# EAGLE board ACE2NOKB (EAGLE 9.4.2), part 1 of 2
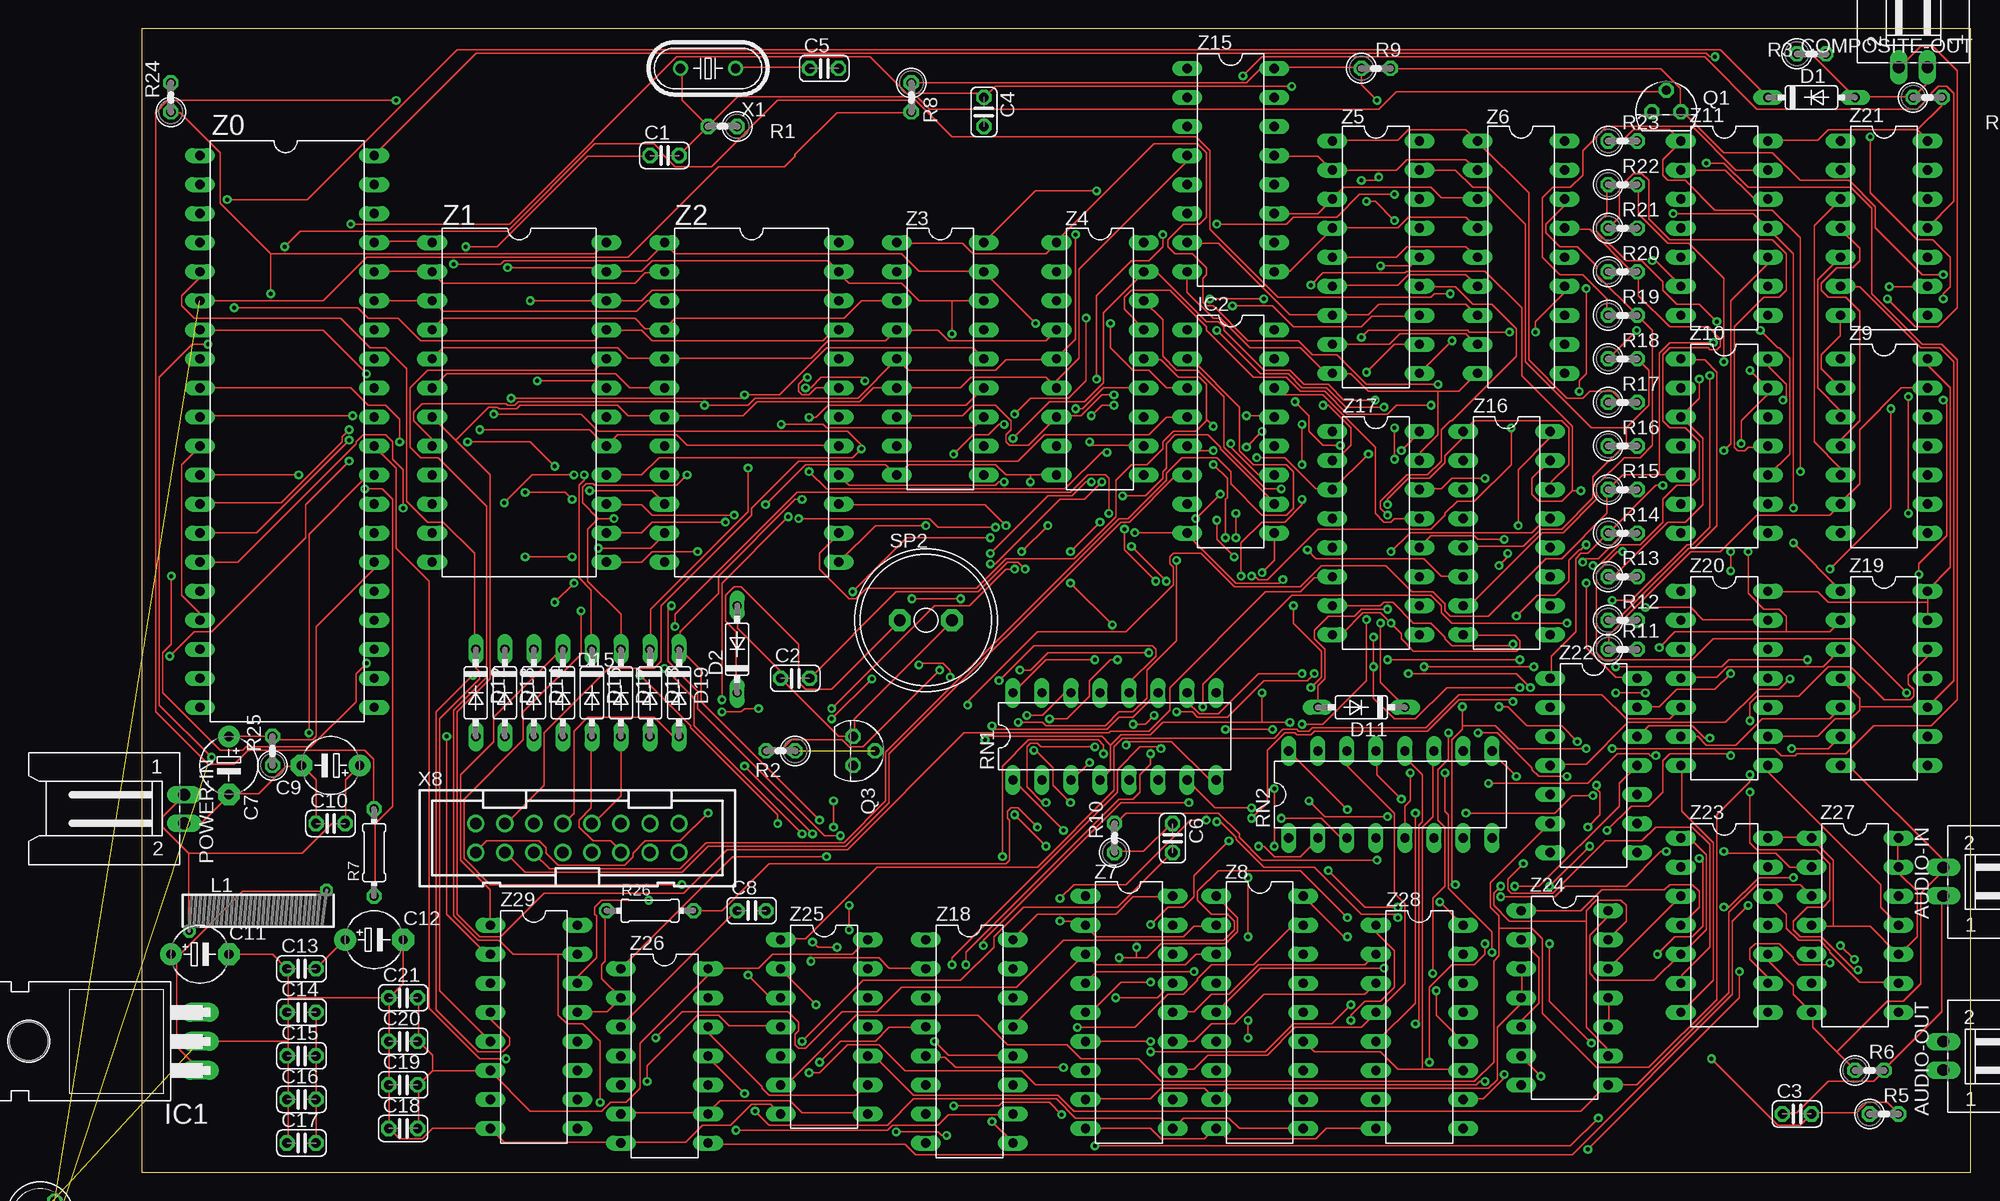
[diagram p2: board, top side]
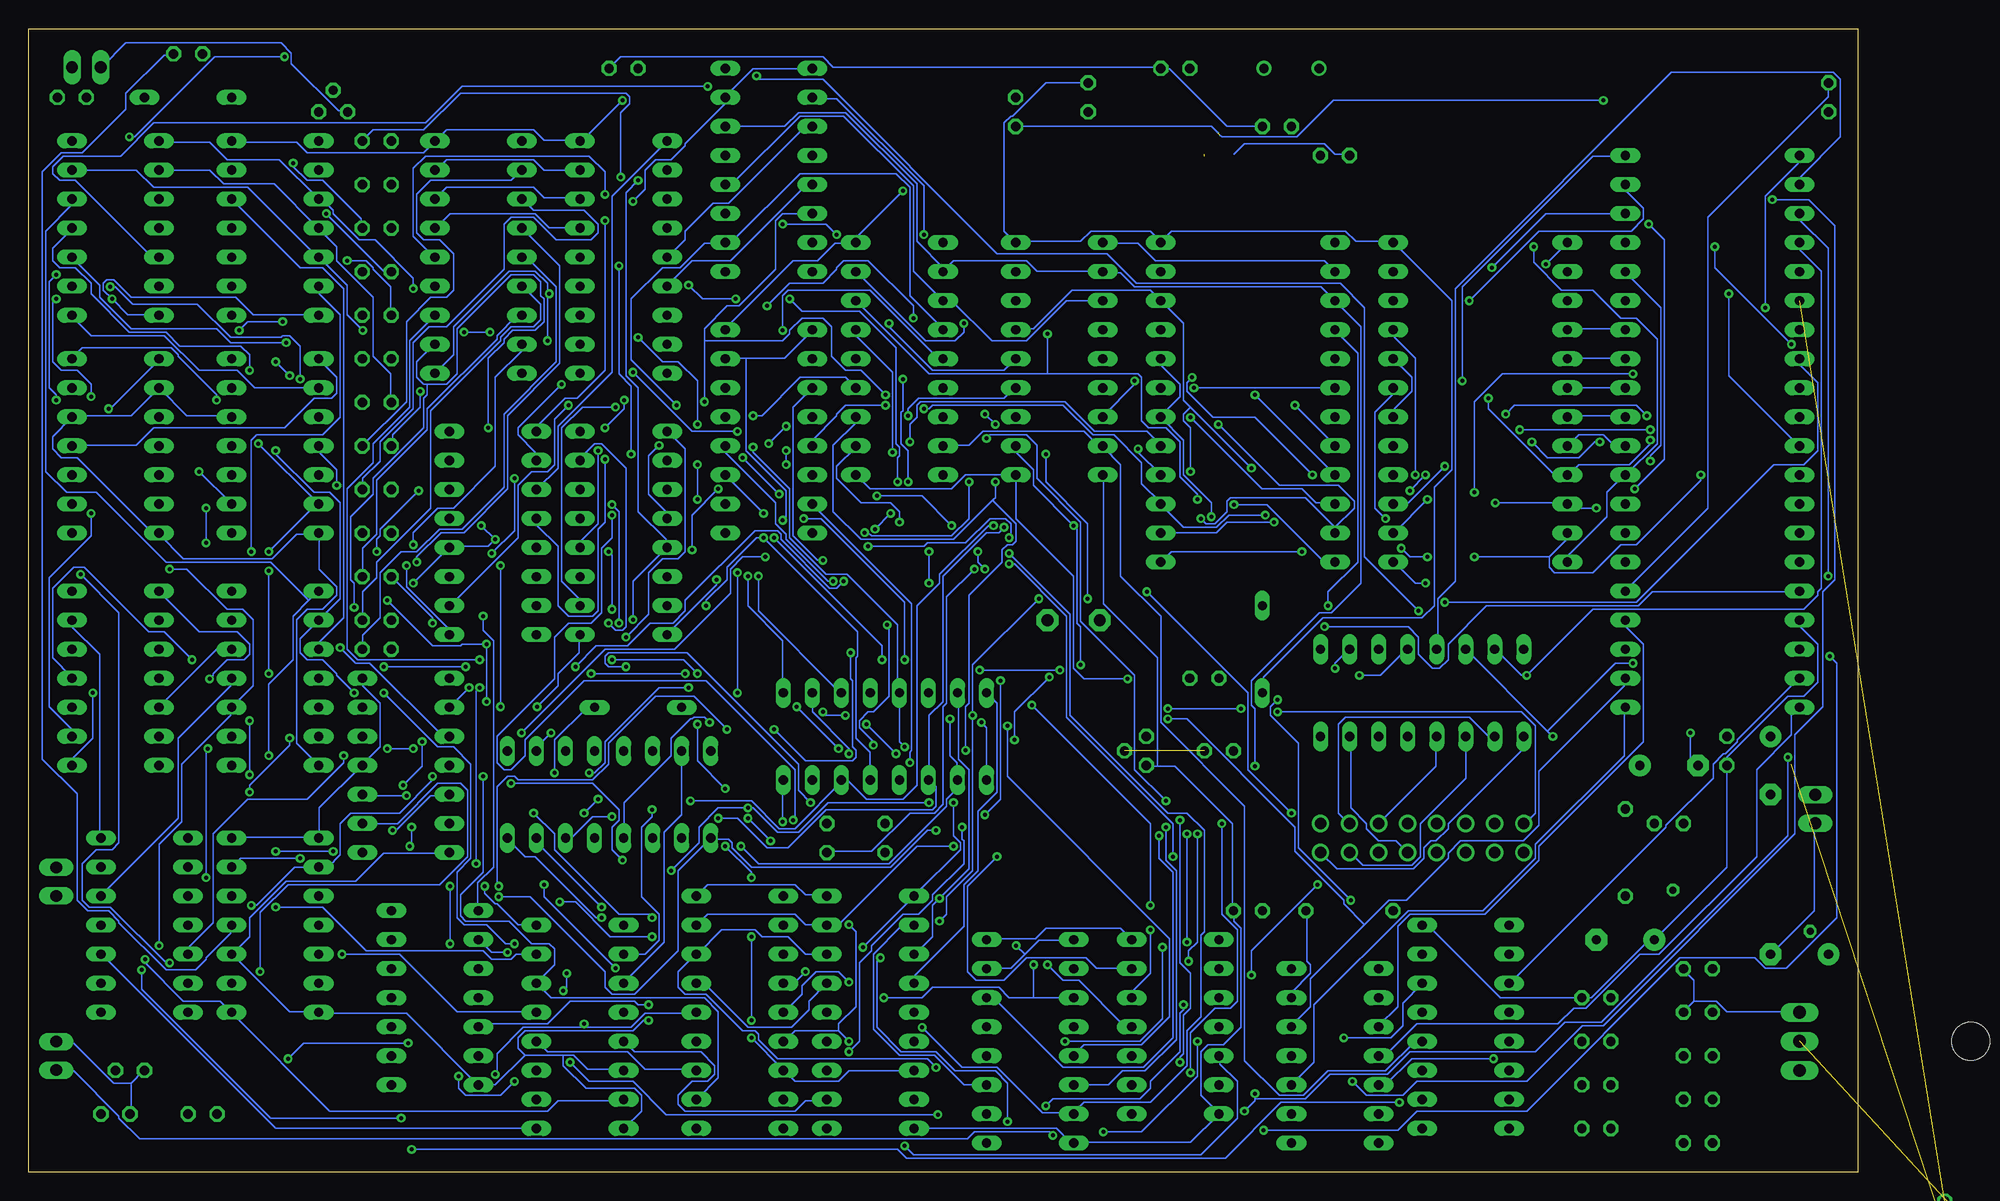
[diagram p3: board, bottom side, seen from below]

Size 160 x 100 mm. Coordinates in mm from the lower left corner, seen from the top.
Outline: 0,0 160,0 160,100 0,100 0,0
Copper layers (1*16): Top 0.035mm / dielectric 1.5mm / Bottom 0.035mm
Design rules "default": minimum track width 6mil, minimum drill 0.35mm, track to track 6mil, track to pad 6mil, pad to pad 6mil, via to via 6mil, smd to smd 6mil, copper to edge 40mil, drill to drill 6mil, minimum pad ring 10mil, minimum via ring 8mil, stop-mask expansion 4mil, vias tented up to drill 0mil, thermal gap 10mil

## Footprints (pad centres in the part's own frame; a part is rotated, then mirrored left to right if it is on the bottom)
L02P = drill 1.016 long: 1 1.25,-6.25; 2 -1.25,-6.25
C025-024X044 = drill 0.813 octagon: 1 -1.27,0; 2 1.27,0
E5-5 = drill 0.813 pad 1.905: + -2.54,0 | drill 0.813 pad 1.905 octagon: - 2.54,0
DO35-7 = drill 0.813 long: A 3.81,0; C -3.81,0
TO220H = drill 1.118 long: 1 -2.54,-10.16; 2 0,-10.16; 3 2.54,-10.16 | hole 3.302: 0,4.826
DIL16 = drill 0.813 long: 1 -8.89,-3.81; 2 -6.35,-3.81; 3 -3.81,-3.81; 4 -1.27,-3.81; 5 1.27,-3.81; 6 3.81,-3.81; 7 6.35,-3.81; 8 8.89,-3.81; 9 8.89,3.81; 10 6.35,3.81; 11 3.81,3.81; 12 1.27,3.81; 13 -1.27,3.81; 14 -3.81,3.81; 15 -6.35,3.81; 16 -8.89,3.81
Z15/4 = drill 0.6 octagon: 1 -6,-1.8; 2 6,1.8
TO92 = drill 0.813 octagon: 1 1.27,0; 2 0,1.905; 3 -1.27,0
TO18 = drill 0.813 octagon: 1 -1.27,-1.27; 2 1.27,-1.27; 3 1.27,1.27
0207/2V = drill 0.813 octagon: 1 -1.27,0; 2 1.27,0
0204/7 = drill 0.813 octagon: 1 -3.81,0; 2 3.81,0
AL11P = drill 1.016 pad 1.905 octagon: + 2.286,0; - -2.286,0
HC49U-V = drill 0.813: 1 -2.413,0; 2 2.413,0
PAK100/2500-16 = drill 1 pad 1.422: 1 -8.89,-1.27; 2 -8.89,1.27; 3 -6.35,-1.27; 4 -6.35,1.27; 5 -3.81,-1.27; 6 -3.81,1.27; 7 -1.27,-1.27; 8 -1.27,1.27; 9 1.27,-1.27; 10 1.27,1.27; 11 3.81,-1.27; 12 3.81,1.27; 13 6.35,-1.27; 14 6.35,1.27; 15 8.89,-1.27; 16 8.89,1.27
DIL40 = drill 0.813 long: 1 -24.13,-7.62; 2 -21.59,-7.62; 3 -19.05,-7.62; 4 -16.51,-7.62; 5 -13.97,-7.62; 6 -11.43,-7.62; 7 -8.89,-7.62; 8 -6.35,-7.62; 9 -3.81,-7.62; 10 -1.27,-7.62; 11 1.27,-7.62; 12 3.81,-7.62; 13 6.35,-7.62; 14 8.89,-7.62; 15 11.43,-7.62; 16 13.97,-7.62; 17 16.51,-7.62; 18 19.05,-7.62; 19 21.59,-7.62; 20 24.13,-7.62; 21 24.13,7.62; 22 21.59,7.62; 23 19.05,7.62; 24 16.51,7.62; 25 13.97,7.62; 26 11.43,7.62; 27 8.89,7.62; 28 6.35,7.62; 29 3.81,7.62; 30 1.27,7.62; 31 -1.27,7.62; 32 -3.81,7.62; 33 -6.35,7.62; 34 -8.89,7.62; 35 -11.43,7.62; 36 -13.97,7.62; 37 -16.51,7.62; 38 -19.05,7.62; 39 -21.59,7.62; 40 -24.13,7.62
DIL24 = drill 0.813 long: 1 -13.97,-7.62; 2 -11.43,-7.62; 3 -8.89,-7.62; 4 -6.35,-7.62; 5 -3.81,-7.62; 6 -1.27,-7.62; 7 1.27,-7.62; 8 3.81,-7.62; 9 6.35,-7.62; 10 8.89,-7.62; 11 11.43,-7.62; 12 13.97,-7.62; 13 13.97,7.62; 14 11.43,7.62; 15 8.89,7.62; 16 6.35,7.62; 17 3.81,7.62; 18 1.27,7.62; 19 -1.27,7.62; 20 -3.81,7.62; 21 -6.35,7.62; 22 -8.89,7.62; 23 -11.43,7.62; 24 -13.97,7.62
DIL18 = drill 0.813 long: 1 -10.16,-3.81; 2 -7.62,-3.81; 3 -5.08,-3.81; 4 -2.54,-3.81; 5 0,-3.81; 6 2.54,-3.81; 7 5.08,-3.81; 8 7.62,-3.81; 9 10.16,-3.81; 10 10.16,3.81; 11 7.62,3.81; 12 5.08,3.81; 13 2.54,3.81; 14 0,3.81; 15 -2.54,3.81; 16 -5.08,3.81; 17 -7.62,3.81; 18 -10.16,3.81
DIL14 = drill 0.813 long: 1 -7.62,-3.81; 2 -5.08,-3.81; 3 -2.54,-3.81; 4 0,-3.81; 5 2.54,-3.81; 6 5.08,-3.81; 7 7.62,-3.81; 8 7.62,3.81; 9 5.08,3.81; 10 2.54,3.81; 11 0,3.81; 12 -2.54,3.81; 13 -5.08,3.81; 14 -7.62,3.81

## Placement (x,y rotation side)
AUDIO-IN  [L02P]  163.83,25.4 270 top
AUDIO-OUT  [L02P]  163.83,10.16 270 top
C1  47N  [C025-024X044]  45.72,88.9 0 top
C2  47N  [C025-024X044]  57.15,43.18 0 top
C3  47N  [C025-024X044]  144.78,5.08 0 top
C4  42p  [C025-024X044]  73.66,92.71 270 top
C5  47N  [C025-024X044]  59.69,96.52 0 top
C6  47N  [C025-024X044]  90.17,29.21 270 top
C7  1U  [E5-5]  7.62,35.56 270 top
C8  2N2  [C025-024X044]  53.34,22.86 0 top
C9  100u  [E5-5]  16.51,35.56 180 top
C10  100N  [C025-024X044]  16.51,30.48 0 top
C11  100u  [E5-5]  5.08,19.05 0 top
C12  100u  [E5-5]  20.32,20.32 0 top
C13  100N  [C025-024X044]  13.97,17.78 0 top
C14  100N  [C025-024X044]  13.97,13.97 0 top
C15  100N  [C025-024X044]  13.97,10.16 0 top
C16  100N  [C025-024X044]  13.97,6.35 0 top
C17  100N  [C025-024X044]  13.97,2.54 0 top
C18  100N  [C025-024X044]  22.86,3.81 0 top
C19  100N  [C025-024X044]  22.86,7.62 0 top
C20  100N  [C025-024X044]  22.86,11.43 0 top
C21  100N  [C025-024X044]  22.86,15.24 0 top
COMPOSITE-OUT  [L02P]  154.94,102.87 0 top
D1  1N4148DO35-7  [DO35-7]  146.05,93.98 0 top
D2  1N4148DO35-7  [DO35-7]  52.07,45.72 90 top
D11  1N4148DO35-7  [DO35-7]  106.68,40.64 180 top
D12  1N4148DO35-7  [DO35-7]  29.21,41.91 270 top
D13  1N4148DO35-7  [DO35-7]  31.75,41.91 270 top
D14  1N4148DO35-7  [DO35-7]  34.29,41.91 270 top
D15  1N4148DO35-7  [DO35-7]  36.83,41.91 270 top
D16  1N4148DO35-7  [DO35-7]  39.37,41.91 270 top
D17  1N4148DO35-7  [DO35-7]  41.91,41.91 270 top
D18  1N4148DO35-7  [DO35-7]  44.45,41.91 270 top
D19  1N4148DO35-7  [DO35-7]  46.99,41.91 270 top
IC1  7805T  [TO220H]  -5.08,11.43 90 top
IC2  74367N  [DIL16]  95.25,64.77 270 top
L1  [Z15/4]  10.16,22.86 0 top
POWER-IN  [L02P]  -2.54,31.75 90 top
Q1  2N3904  [TO92]  133.35,92.71 0 top
Q2  2N2369  [TO18]  -8.89,-3.81 0 top  (outside the outline)
Q3  BC237  [TO92]  62.23,36.83 270 top
R1  47k  [0207/2V]  50.8,91.44 180 top
R2  12k  [0207/2V]  55.88,36.83 180 top
R3  1K5  [0207/2V]  146.05,97.79 0 top
R4  1K5  [0207/2V]  156.21,93.98 0 top
R5  12k  [0207/2V]  152.4,5.08 0 top
R6  1K  [0207/2V]  151.13,8.89 0 top
R7  1k0  [0204/7]  20.32,27.94 90 top
R8  270R  [0207/2V]  67.31,93.98 270 top
R9  47k  [0207/2V]  107.95,96.52 0 top
R10  10k  [0207/2V]  85.09,29.21 90 top
R11  1k  [0207/2V]  129.54,45.72 0 top
R12  1k  [0207/2V]  129.54,48.26 0 top
R13  1k  [0207/2V]  129.54,52.07 0 top
R14  1k  [0207/2V]  129.54,55.88 0 top
R15  1k  [0207/2V]  129.54,59.69 0 top
R16  1k  [0207/2V]  129.54,63.5 0 top
R17  1k  [0207/2V]  129.54,67.31 0 top
R18  1k  [0207/2V]  129.54,71.12 0 top
R19  1k  [0207/2V]  129.54,74.93 0 top
R20  1k  [0207/2V]  129.54,78.74 0 top
R21  1k  [0207/2V]  129.54,82.55 0 top
R22  1k  [0207/2V]  129.54,86.36 0 top
R23  1k  [0207/2V]  129.54,90.17 0 top
R24  10k  [0207/2V]  2.54,93.98 90 top
R25  220k  [0207/2V]  11.43,36.83 90 top
R26  330R  [0204/7]  44.45,22.86 0 top
RN1  1K0  [DIL16]  85.09,38.1 0 top
RN2  1K0  [DIL16]  109.22,33.02 0 top
SP2  AL11P  [AL11P]  68.58,48.26 0 top
X1  6.556MHz  [HC49U-V]  49.53,96.52 180 top
X8  2516-  [PAK100/2500-16]  38.1,29.21 0 top
Z0  [DIL40]  12.7,64.77 270 top
Z1  [DIL24]  33.02,67.31 270 top
Z2  [DIL24]  53.34,67.31 270 top
Z3  [DIL18]  69.85,71.12 270 top
Z4  [DIL18]  83.82,71.12 270 top
Z5  [DIL18]  107.95,80.01 270 top
Z6  [DIL18]  120.65,80.01 270 top
Z7  [DIL18]  86.36,13.97 270 top
Z8  [DIL18]  97.79,13.97 270 top
Z9  74LS393N  [DIL14]  152.4,63.5 270 top
Z10  74LS393N  [DIL14]  138.43,63.5 270 top
Z11  74LS393N  [DIL14]  138.43,82.55 270 top
Z15  74367N  [DIL16]  95.25,87.63 270 top
Z16  74367N  [DIL16]  119.38,55.88 270 top
Z17  74367N  [DIL16]  107.95,55.88 270 top
Z18  74367N  [DIL16]  72.39,11.43 270 top
Z19  74LS00N  [DIL14]  152.4,43.18 270 top
Z20  74LS08N  [DIL14]  138.43,43.18 270 top
Z21  74LS11N  [DIL14]  152.4,82.55 270 top
Z22  74LS11N  [DIL14]  127,35.56 270 top
Z23  74LS86N  [DIL14]  138.43,21.59 270 top
Z24  74LS02N  [DIL14]  124.46,15.24 270 top
Z25  74LS02N  [DIL14]  59.69,12.7 270 top
Z26  74LS32N  [DIL14]  45.72,10.16 270 top
Z27  74LS74N  [DIL14]  149.86,21.59 270 top
Z28  74LS166N  [DIL16]  111.76,12.7 270 top
Z29  74LS138N  [DIL16]  34.29,12.7 270 top

## Tracks (layer width: path | path; a pad name or v marks a point on that pad's centre or on a via)
+9VDC
  Top 0.152: 3.05,19.05 2.59,19.05 C11.+ 3.05,19.05 | 3.05,19.05 3.35,19.05 8.84,24.54 16.15,24.54 L1.2 | 3.05,19.05 3.05,10.97 5.03,8.99 IC1.1
/BUSRQ
  Bottom 0.152: R24.2 2.59,95.25 2.59,94.03 13.11,83.52 13.11,58.06 20.27,50.9 Z0.25
/CLK  (via drill 0.35)
  Top 0.152: v149.81,18.59 v148.59,19.81 | v153.01,66.75 153.01,58.06 v147.68,52.73
  Bottom 0.152: Z28.7 108.05,6.25 113.69,6.25 114.61,5.33 133.66,5.33 142.19,13.87 Z23.8 142.34,14.02 143.26,14.94 146.46,14.94 149.81,18.29 v149.81,18.59 | v148.59,19.81 148.59,28.65 146.61,30.63 146.61,35.66 142.34,39.93 142.34,40.54 Z20.10 142.19,40.69 140.36,42.52 140.36,48.31 141.28,49.23 142.65,49.23 146.15,52.73 v147.68,52.73 | v153.01,66.75 152.86,66.75 148.59,71.02 Z9.1
/INT  (via drill 0.35)
  Top 0.152: v46.63,47.7 46.63,48.77 57.3,59.44 81.23,59.44 82.75,60.96 84.28,60.96 84.58,60.66 v84.58,57.61 | v85.95,56.24 85.95,54.41 v88.7,51.66 | v121.77,44.2 v112.17,44.2 | v128.93,44.2 138.23,44.2 138.84,44.81 v145.69,44.81
  Bottom 0.152: v46.63,47.7 39.32,47.7 38.41,46.79 38.41,45.26 37.19,44.04 36.58,44.04 35.81,44.81 35.81,46.18 32.46,49.53 19.2,49.53 17.98,50.75 5.18,50.75 Z0.16 | v85.95,56.24 v84.58,57.61 | v88.7,51.66 89.31,51.05 89.92,51.05 94.18,55.32 94.18,55.78 94.49,56.08 96.47,56.08 102.56,49.99 102.56,49.07 103.63,48.01 105.61,48.01 107.59,46.02 110.34,46.02 v112.17,44.2 | v128.93,44.2 v121.77,44.2 | v145.69,44.81 148.13,47.24 149.5,47.24 155.14,52.88 156.06,52.88 157.89,51.05 157.89,44.96 156.21,43.28 Z19.11
/IOREQ
  Bottom 0.152: Z26.4 41.91,10.21 41.3,10.21 38.56,12.95 26.21,12.95 24.84,14.33 23.77,14.33 19.05,19.05 17.37,19.05 8.84,27.58 8.84,35.2 5.79,38.25 5.79,39.93 5.18,40.54 Z0.20
/MREQ
  Bottom 0.152: Z0.19 5.18,43.13 10.52,37.8 10.52,37.64 11.58,36.58 11.73,36.58 12.65,35.66 12.65,34.44 16.76,30.33 16.76,30.18 30.48,16.46 Z29.3
/RD
  Bottom 0.152: Z26.10 47.55,9.6 47.55,14.63 39.32,22.86 32.77,22.86 28.19,27.43 28.19,28.65 20.42,36.42 20.42,40.54 Z0.21
/RESET
  Top 0.152: C7.+ R25.2 11.73,37.8 14.94,37.8 15.24,38.1 15.24,47.7 20.27,52.73 20.27,53.34 Z0.26
/VHOLD  (via drill 0.35)
  Top 0.152: v59.89,27.58 51.66,27.58 41.91,17.83 Z26.1 | v74.22,53.19 74.68,53.19 80.31,58.83 82.45,58.83 v83.97,60.35 | v98.15,76.35 v93.42,76.35 | v102.26,77.57 103.33,78.64 110.49,78.64 110.64,78.79 117.5,78.79 120.7,75.59 120.7,69.65 125.12,65.23 125.12,59.59 | 125.12,59.59 124.21,58.67 122.22,58.67 121.61,59.28 121.61,60.66 123.14,62.18 Z16.15 | v154.38,41.91 149.66,46.63 137.47,46.63 135.64,44.81 127.86,44.81 127.25,45.41 127.25,52.43 129.08,54.25 v129.54,54.25 | 125.12,59.59 v125.88,59.59
  Bottom 0.152: v59.89,27.58 59.89,30.48 69.19,39.78 69.19,48.62 73.76,53.19 v74.22,53.19 | v83.97,60.35 83.97,62.48 83.82,62.64 83.82,63.4 84.12,63.7 84.12,72.08 87.33,75.29 92.35,75.29 v93.42,76.35 | v98.15,76.35 101.04,76.35 v102.26,77.57 | v154.38,41.91 154.38,37.95 156.21,36.12 156.21,35.66 Z19.8 | v129.54,54.25 129.54,55.32 129.24,55.63 129.24,56.24 v125.88,59.59
/WAIT
  Top 0.152: C8.1 51.97,22.86 41.91,12.8 Z26.3
  Bottom 0.152: Z0.24 20.27,48.16 20.27,47.7 18.75,46.18 18.75,37.64 27.89,28.5 27.89,27.28 32.61,22.55 39.17,22.55 40.23,21.49 40.23,14.48 41.91,12.8 Z26.3
/WR  (via drill 0.35)
  Top 0.152: Z26.12 49.53,12.65 49.53,12.19 54.25,7.47 54.25,7.32 54.86,6.71 62.48,6.71 63.4,7.62 Z25.9 | v60.35,39.62 v63.86,43.13
  Bottom 0.152: Z4.10 86.41,59.74 79.25,59.74 78.03,60.96 73.76,60.96 Z3.10 73.61,60.96 73.61,57.15 68.58,52.12 68.58,44.04 67.67,43.13 v63.86,43.13 | 43.13,21.64 47.85,16.92 47.85,14.48 49.53,12.8 Z26.12 | 43.13,21.64 41,23.77 39.47,23.77 35.81,27.43 35.81,27.89 34.75,28.96 29.26,28.96 27.89,30.33 27.89,35.05 20.42,42.52 20.42,43.13 Z0.22 | v60.35,39.62 58.67,39.62 49.23,30.18 49.23,28.04 44.96,23.77 44.96,23.47 43.13,21.64
ADDRESS0  (via drill 0.35)
  Top 0.152: v31.85,9.91 29.57,9.91 25.15,14.33 25.15,51.66 22.25,54.56 22.25,61.57 20.42,63.4 Z0.30 | v108.66,66.9 105.31,66.9 103.63,68.58 101.5,68.58 100.28,69.8 97.84,69.8 v94.03,73.61 | v81.69,81.99 81.69,72.85 80.01,71.17 Z4.5 80.01,71.02 75.59,71.02 74.68,70.1 67.06,70.1 66.14,71.02 Z3.5 65.99,71.02 62.64,67.67 53.65,67.67 53.03,67.06 v49.23,67.06 48.92,67.36 32.92,67.36 32.61,67.06 32,67.06 31.85,67.21 24.54,67.21 23.77,66.45 23.77,65.68 25.3,64.16 25.3,63.55 Z1.8
  Bottom 0.152: Z0.30 20.42,63.55 21.34,63.55 22.25,64.47 24.38,64.47 25.3,63.55 Z1.8 | Z26.5 41.3,7.62 39.01,9.91 v31.85,9.91 | v49.23,67.06 45.72,63.55 Z2.8 | v108.66,66.9 111.56,66.9 113.39,65.08 113.39,51.66 111.86,50.14 111.86,49.53 Z17.10 | v94.03,73.61 94.03,76.66 93.57,77.11 86.41,77.11 80.47,71.17 80.01,71.17 Z4.5 | v81.69,81.99 81.69,86.26 89.31,93.88 91.44,93.88 Z15.2
ADDRESS1
  Top 0.152: 79.7,68.89 Z4.6 79.7,68.89 | 79.7,68.89 79.1,69.49 72.54,69.49 71.63,68.58 66.14,68.58 Z3.6 65.99,68.58 64.01,68.58 62.79,67.36 53.8,67.36 52.58,66.14 45.72,66.14 | 79.7,68.89 81.99,71.17 81.99,78.94 91.44,88.39 91.44,88.85 Z15.4 | 27.43,64.01 25.45,65.99 Z1.7 | 27.43,64.01 30.48,60.96 30.48,43.13 27.58,40.23 27.58,22.55 29.57,20.57 31.39,20.57 35.2,24.38 47.4,24.38 51.21,28.19 61.72,28.19 71.93,38.41 84.58,38.41 84.73,38.56 88.09,38.56 89.92,40.39 89.92,42.37 98.3,50.75 101.35,50.75 102.56,51.97 104.09,51.97 Z17.6 | 45.72,66.14 42.52,66.14 41.6,67.06 33.07,67.06 32.77,66.75 31.24,66.75 31.09,66.9 30.33,66.9 27.43,64.01 | 45.72,66.14 Z2.7 45.72,66.14
  Bottom 0.152: Z0.31 20.42,66.14 25.3,66.14 Z1.7
ADDRESS2  (via drill 0.35)
  Top 0.152: Z2.6 42.67,68.58 41.45,69.8 26.67,69.8 25.45,68.58 Z1.6 | Z3.7 66.14,66.14 71.78,66.14 72.69,67.06 74.68,67.06 76.05,65.68 76.05,64.92 75.59,64.47 75.59,63.86 75.89,63.55 77.57,63.55 80.01,65.99 Z4.7 80.01,66.14 82.14,66.14 83.97,67.97 v85.04,67.97 | v104.85,63.55 103.33,63.55 102.11,64.77 102.11,66.14 v100.89,67.36 | v58.06,68.58 58.52,68.58 59.44,69.49 62.94,69.49 v63.25,69.19
  Bottom 0.152: Z0.32 20.42,68.58 25.3,68.58 Z1.6 | v104.85,63.55 105.77,62.64 105.77,59.28 104.24,57.76 104.24,57.15 Z17.4 | 100.89,72.69 100.89,73.76 98.91,75.74 97.84,75.74 94.64,78.94 94.64,83.21 94.03,83.82 Z15.6 | 100.89,72.69 v100.89,67.36 | v85.04,67.97 87.17,70.1 88.54,70.1 89.76,71.32 89.76,73.91 90.53,74.68 92.35,74.68 93.42,73.61 93.42,73.3 94.03,72.69 100.89,72.69 | v58.06,68.58 Z2.6 | v63.25,69.19 63.25,68.89 65.99,66.14 Z3.7
ADDRESS3  (via drill 0.35)
  Top 0.152: 45.72,71.17 42.52,71.17 41.6,72.08 26.36,72.08 25.45,71.17 Z1.5 | 45.72,71.17 Z2.5 45.72,71.17 | Z4.4 80.01,73.61 79.1,72.69 70.56,72.69 69.65,73.61 66.14,73.61 Z3.4 65.99,73.61 65.08,72.69 60.05,72.69 58.52,71.17 45.72,71.17 | v103.33,67.06 103.78,67.06 105.77,65.08 105.77,63.55 104.55,62.33 104.24,62.33 Z17.2
  Bottom 0.152: Z0.33 20.42,71.17 25.3,71.17 Z1.5 | Z4.4 80.01,73.76 82.91,76.66 82.91,86.11 84.12,87.33 92.51,87.33 98.45,81.38 99.06,81.38 Z15.10 99.06,81.23 100.89,81.23 103.02,79.1 104.55,79.1 107.29,76.35 107.29,71.02 v103.33,67.06
ADDRESS4  (via drill 0.35)
  Top 0.152: 45.72,73.76 44.04,73.76 43.13,74.68 26.36,74.68 25.45,73.76 Z1.4 | 45.72,73.76 Z2.4 45.72,73.76 | v61.11,29.41 59.74,29.41 48.62,40.54 48.62,42.06 46.02,44.65 46.02,49.23 v46.33,49.53 | 45.72,73.76 46.63,74.68 61.42,74.68 62.94,76.2 65.99,76.2 Z3.3
  Bottom 0.152: Z3.3 66.14,76.2 69.19,76.2 72.69,72.69 75.74,72.69 79.25,76.2 Z4.3 82.6,78.79 82.6,86.26 88.7,92.35 92.51,92.35 98.45,86.41 99.06,86.41 Z15.12 | Z0.34 20.42,73.76 25.3,73.76 Z1.4 | Z18.14 75.59,15.24 69.49,9.14 62.48,9.14 59.89,11.73 59.89,26.21 61.11,27.43 v61.11,29.41 | v46.33,49.53 46.33,50.75 43.74,53.34 43.74,71.63 45.72,73.61 Z2.4
ADDRESS5  (via drill 0.35)
  Top 0.152: Z0.35 20.42,76.2 25.3,76.2 Z1.3 25.45,76.2 26.36,75.29 43.28,75.29 44.2,76.2 Z2.3 | v69.34,11.43 70.56,10.21 76.2,10.21 Z18.12 | v60.81,19.66 59.13,19.66 v58.67,20.12 | v52.73,35.51 v58.67,29.57
  Bottom 0.152: 79.86,78.94 80.01,78.79 Z4.2 79.86,78.94 | 79.86,78.94 79.1,79.7 72.69,79.7 71.78,78.79 66.14,78.79 Z3.2 65.99,78.64 64.47,78.64 63.25,77.42 46.94,77.42 Z2.3 43.43,73.91 43.43,51.51 46.02,48.92 47.09,48.92 53.03,42.98 53.03,40.84 52.73,40.54 v52.73,35.51 | Z15.14 93.88,91.44 92.66,92.66 88.54,92.66 82.3,86.41 82.3,81.38 79.86,78.94 | v69.34,11.43 62.79,11.43 60.81,13.41 v60.81,19.66 | v58.67,29.57 v58.67,20.12
ADDRESS6  (via drill 0.35)
  Top 0.152: Z3.1 66.14,81.23 71.78,81.23 72.69,80.31 79.1,80.31 80.01,81.23 Z4.1 80.01,81.38 88.54,89.92 92.35,89.92 93.12,89.15 93.12,83.52 92.51,82.91 91.14,82.91 89.76,81.53 89.76,80.92 90.37,80.31 91.9,80.31 93.12,79.1 93.12,78.49 92.81,78.18 92.81,76.05 93.12,75.74 93.73,75.74 96.77,72.69 101.19,72.69 102.41,71.48 104.55,71.48 107.14,68.89 v113.39,68.89 | Z0.36 20.42,78.79 25.3,78.79 Z1.2 25.45,78.64 26.36,77.72 43.13,77.72 44.04,78.64 45.72,78.64 Z2.2 | v51.97,3.66 65.23,3.66 65.68,4.12 69.65,4.12 70.56,5.03 76.2,5.03 Z18.10 | v2.44,45.11 4.57,47.24 6.1,47.24 14.33,55.47 14.33,58.37 v18.14,62.18
  Bottom 0.152: v113.39,68.89 117.2,65.08 117.2,64.47 115.67,62.94 115.67,62.33 Z16.2 | v51.97,3.66 40.23,3.66 38.56,5.33 28.96,5.33 15.54,18.75 8.99,18.75 8.08,17.83 6.25,17.83 1.83,22.25 1.83,44.5 v2.44,45.11 | v18.14,62.18 18.14,62.64 17.22,63.55 17.22,75.59 20.27,78.64 Z0.36 | Z3.1 65.99,81.23 62.94,81.23 61.42,79.7 46.63,79.7 45.72,78.79 Z2.2
ADDRESS7  (via drill 0.35)
  Top 0.152: Z0.37 20.42,81.38 25.3,81.38 Z1.1 | 45.72,81.23 46.63,80.31 66.45,80.31 67.97,78.79 73.61,78.79 Z3.17 73.76,78.64 v78.18,74.22 | 45.72,81.23 Z2.1 45.72,81.23 | v27.28,79.4 31.39,79.4 31.7,79.7 44.2,79.7 45.72,81.23 | v60.5,32.46 v60.5,30.18 | v76.2,64.16 79.4,67.36 82.45,67.36 84.12,69.04 84.12,75.13 87.63,78.64 | 87.63,78.64 Z4.17 87.63,78.64 | v109.58,65.08 v109.58,62.33 | v107.9,67.51 105.16,67.51 103.78,68.89 101.65,68.89 100.43,70.1 98.15,70.1 94.64,73.61 94.64,73.91 94.18,74.37 93.12,74.37 88.85,78.64 87.63,78.64
  Bottom 0.152: v27.28,79.4 25.45,81.23 Z1.1 | Z18.6 65.53,7.62 64.31,8.84 62.33,8.84 59.59,11.58 59.59,26.36 60.5,27.28 v60.5,30.18 | v60.5,32.46 63.25,35.2 63.25,43.43 67.97,48.16 67.97,56.84 71.78,60.66 71.78,63.55 72.69,64.47 75.89,64.47 v76.2,64.16 | v109.58,62.33 109.58,56.84 110.19,56.24 110.19,49.07 110.64,48.62 112.78,48.62 113.69,49.53 113.69,54.71 115.52,56.54 115.52,57.15 Z16.4 | v109.58,65.08 107.9,66.75 v107.9,67.51 | v78.18,74.22 78.18,73.46 78.94,72.69 81.53,72.69 87.63,78.79 Z4.17
ADDRESS8  (via drill 0.35)
  Top 0.152: 70.87,76.2 67.97,76.2 66.45,77.72 61.87,77.72 60.96,78.64 Z2.23 60.96,78.79 60.05,79.7 44.65,79.7 43.74,78.79 40.69,78.79 Z1.23 40.54,78.79 40.23,79.1 v32,79.1 | 70.87,76.2 73.61,76.2 Z3.16 | 47.09,45.72 47.09,47.24 50.44,50.6 50.44,52.12 57.15,58.83 v57.76,58.83 | 47.09,45.72 D19.C 47.09,45.72 | v59.28,9.6 61.11,11.43 64.16,11.43 65.38,12.65 68.58,12.65 Z18.4 | v59.28,30.79 48.92,41.15 48.92,43.89 47.09,45.72 | v101.96,54.41 102.72,53.65 112.17,53.65 113.69,52.12 115.52,52.12 Z16.6 | v99.67,59.74 98.3,59.74 94.64,63.4 94.64,67.82 92.35,70.1 90.53,70.1 89.31,71.32 89.31,74.52 Z4.16 | v70.87,73.3 70.87,76.2
  Bottom 0.152: v32,79.1 27.28,83.82 20.42,83.82 Z0.38 | v57.76,58.83 57.76,59.28 59.28,60.81 59.28,63.86 60.5,65.08 62.03,65.08 62.64,65.68 62.64,69.49 62.94,69.8 70.87,69.8 | 70.87,69.8 81.23,69.8 Z4.16 | v59.28,9.6 59.28,10.06 58.98,10.36 58.98,13.72 58.37,14.33 58.37,17.37 59.28,18.29 v59.28,30.79 | v101.96,54.41 101.96,57.45 v99.67,59.74 | 70.87,69.8 v70.87,73.3
ADDRESS9  (via drill 0.35)
  Top 0.152: v112.78,67.06 109.73,67.06 108.97,66.29 105.46,66.29 103.48,68.28 101.35,68.28 100.13,69.49 97.23,69.49 93.12,73.61 93.12,73.91 89.92,77.11 86.56,77.11 85.95,76.5 85.95,75.44 87.63,73.76 Z4.15 | v53.03,61.57 53.03,57.76 44.5,49.23 44.5,45.72 D18.C | v58.52,18.44 58.83,18.75 64.47,18.75 65.38,17.83 68.58,17.83 Z18.2 | v57.76,29.57 48.31,39.01 48.31,41.45 v45.72,44.04 | Z2.22 60.05,77.11 44.65,77.11 43.74,76.2 40.69,76.2 Z1.22 40.54,76.2 v33.98,76.2 | v84.43,62.94 83.97,62.94 80.77,59.74 59.89,59.74 v58.37,61.27
  Bottom 0.152: v112.78,67.06 114,65.84 114,61.87 114.61,61.27 115.98,61.27 117.2,60.05 117.2,55.47 123.14,49.53 Z16.10 | 58.37,66.9 58.98,67.51 58.98,74.22 Z2.22 61.87,77.11 68.73,77.11 72.08,73.76 73.61,73.76 Z3.15 | 58.37,66.9 v53.03,61.57 | v58.52,18.44 58.52,19.36 57.76,20.12 v57.76,29.57 | v45.72,44.04 45.72,44.5 44.5,45.72 D18.C | v33.98,76.2 27.89,82.3 19.81,82.3 18.75,83.36 18.75,84.28 20.27,85.8 20.27,86.26 Z0.39 | v84.43,62.94 84.43,69.95 87.63,73.15 87.63,73.61 Z4.15 | v58.37,61.27 58.37,65.08 58.98,65.68 58.98,66.29 58.37,66.9
ADDRESS10  (via drill 0.35)
  Top 0.152: 39.93,57.15 v41.3,57.15 | 39.93,57.15 39.01,56.24 39.01,51.66 41.91,48.77 D17.C | v34.59,69.19 39.93,69.19 40.54,68.58 Z1.19 | Z2.19 58.98,68.58 58.37,67.97 57.76,67.97 57.45,68.28 57.45,68.89 58.06,69.49 v58.22,69.49 | v47.7,60.96 46.79,60.05 39.62,60.05 39.47,60.2 38.86,60.2 38.56,59.89 38.56,58.52 39.93,57.15 | v154.53,67.82 v154.53,57.61 | v157.58,76.35 157.58,76.81 158.19,77.42 158.19,80.01 156.67,81.53 155.3,81.53 151.18,85.65 v151.18,90.53 | v137.62,97.54 137.16,97.54 136.85,97.84 29.26,97.84 20.42,89 Z0.40
  Bottom 0.152: v41.3,57.15 42.22,58.06 42.22,66.45 40.69,67.97 40.69,68.58 Z1.19 | v34.59,69.19 34.59,77.42 23.16,88.85 20.42,88.85 Z0.40 | v58.22,69.49 58.67,69.04 58.67,68.28 56.39,65.99 52.73,65.99 v47.7,60.96 | Z19.9 156.21,38.71 158.19,40.69 158.19,51.97 154.53,55.63 v154.53,57.61 | v154.53,67.82 154.53,68.89 155.75,70.1 157.12,70.1 157.89,70.87 157.89,76.05 v157.58,76.35 | v151.18,90.53 150.72,90.53 143.71,97.54 v137.62,97.54
ADDRESS11  (via drill 0.35)
  Top 0.152: Z2.21 60.96,73.61 60.5,73.61 59.59,72.69 44.65,72.69 43.74,73.61 40.69,73.61 Z1.21 40.54,73.61 39.62,72.69 24.38,72.69 22.4,74.68 19.81,74.68 18.9,75.59 v8.08,75.59 | v122.38,8.38 120.7,10.06 Z24.6 | v117.5,7.92 117.04,7.92 116.74,7.62 78.18,7.62 76.96,8.84 66.75,8.84 64.47,11.12 61.72,11.12 59.28,8.69 v58.37,8.69 | v55.63,30.48 55.63,31.24 48.01,38.86 48.01,39.01 v43.59,43.43 | v38.71,60.96 38.71,60.5 38.25,60.05 38.25,51.97 39.32,50.9 39.32,45.72 D16.C
  Bottom 0.152: v8.08,75.59 8.08,85.34 5.18,88.24 5.18,88.85 Z0.1 | v122.38,8.38 122.38,7.32 121.77,6.71 118.72,6.71 v117.5,7.92 | v58.37,8.69 58.37,12.19 56.24,14.33 54.86,14.33 54.25,14.94 54.25,21.18 55.63,22.55 v55.63,30.48 | v43.59,43.43 41.76,43.43 39.47,45.72 D16.C | v38.71,60.96 38.71,71.17 40.54,73 40.54,73.61 Z1.21
ADDRESS12
  Top 0.152: Z29.1 30.48,21.64 30.48,24.69 27.89,27.28 27.89,34.75 30.79,37.64 30.79,39.78 36.73,45.72 D15.C
  Bottom 0.152: Z0.2 5.03,86.41 5.03,87.02 1.52,90.53 1.52,95.56 2.13,96.16 16.31,96.16 35.2,77.27 35.2,51.66 36.73,50.14 36.73,45.72 D15.C
ADDRESS13  (via drill 0.35)
  Top 0.152: Z29.2 30.18,19.05 26.67,22.55 v26.67,38.1 | v2.59,52.12 2.59,46.18 1.83,45.41 1.83,41.91 6.86,36.88 8.84,36.88 9.14,37.19 14.78,37.19 18.75,41.15 18.75,43.59 v19.66,44.5
  Bottom 0.152: D14.C 27.13,38.56 | 27.13,38.56 v26.67,38.1 | v2.59,52.12 2.59,80.77 5.03,83.21 5.03,83.82 Z0.3 | v19.66,44.5 21.18,44.5 27.13,38.56
ADDRESS14  (via drill 0.35)
  Top 0.152: v28.96,43.43 25.76,40.23 25.76,14.17 29.41,10.52 31.55,10.52 32.16,11.12 32.16,11.73 30.48,13.41 30.48,13.87 Z29.4
  Bottom 0.152: D13.C 31.7,45.72 29.41,43.43 v28.96,43.43 23.16,49.23 4.72,49.23 3.5,50.44 3.5,50.75 3.2,51.05 3.2,78.79 5.03,80.62 5.03,81.23 Z0.4
ADDRESS15
  Top 0.152: Z29.5 26.06,15.85 26.06,39.62 29.57,43.13 29.57,43.74 29.26,44.04 29.26,45.72 D12.C 29.11,45.72 29.11,54.1 26.36,56.84 24.99,56.84 23.16,58.67 23.16,70.26 21.34,72.08 19.96,72.08 17.37,74.68 4.57,74.68 3.5,75.74 3.5,76.66 5.03,78.18 5.03,78.64 Z0.5
CNT0  (via drill 0.35)
  Top 0.152: Z21.5 146.61,78.03 146.61,68.58 148.59,66.6 148.59,66.14 Z9.3 | v19.51,59.74 21.03,59.74 21.95,58.83 21.95,32 20.42,30.48 20.42,24.23 R7.1 | v18.29,82.91 32.16,82.91 46.79,97.54 63.7,97.54 66.9,94.34 73.3,94.34 73.61,94.03 C4.1 73.76,94.03 74.68,94.94 v100.58,94.94
  Bottom 0.152: v19.51,59.74 16.92,62.33 16.92,81.53 v18.29,82.91 | Z21.5 149.2,80.01 155.91,86.72 157.28,86.72 157.89,87.33 157.89,87.94 156.97,88.85 151.94,88.85 149.05,91.75 125.27,91.75 122.07,94.94 v100.58,94.94
CNT1
  Top 0.152: Z9.4 148.59,63.55 148.59,64.01 150.27,65.68 150.27,75.29 149.05,76.5 147.52,76.5 146.91,77.11 146.91,77.72 148.28,79.1 149.66,79.1 150.27,79.7 150.27,80.77 148.59,82.45 Z21.4
CNT2
  Top 0.152: Z9.5 148.59,61.57 146.3,63.86 146.3,82.75 148.59,85.04 Z21.3
CNT3
  Top 0.152: R11.1 128.32,45.72 128.32,46.94 129.84,48.46 129.84,48.62 135.48,54.25 138.07,54.25 141.28,57.45 147.68,57.45 148.59,58.37 Z9.6 148.59,58.52 150.27,60.2 150.27,64.92 153.92,68.58 Z9.13
CNT4
  Top 0.152: R12.1 128.32,48.31 129.08,48.31 135.33,54.56 135.79,54.56 137.77,56.54 137.77,69.95 136.7,71.02 134.72,71.02 Z10.1
  Bottom 0.152: Z9.11 156.21,63.55 150.57,63.55 149.05,65.08 137.62,65.08 135.03,67.67 133.5,67.67 133.04,68.12 133.04,69.49 134.57,71.02 Z10.1
CNT5  (via drill 0.35)
  Top 0.152: v70.87,18.14 70.87,18.75 85.34,33.22 85.34,35.2 87.33,37.19 89,37.19 v89.15,37.03 | v92.81,40.69 92.81,42.67 100.58,50.44 112.78,50.44 113.69,49.53 113.69,48.92 114.61,48.01 v124.66,48.01 | R13.1 128.32,52.12 128.78,52.12 133.5,56.84 135.03,56.84 136.55,58.37 136.55,64.16 134.72,65.99 Z10.3 134.72,66.14 136.25,67.67 v136.25,69.34 | v152.86,77.42 156.21,77.42 Z21.9
  Bottom 0.152: v70.87,18.14 69.49,16.76 68.12,16.76 64.16,12.8 63.55,12.8 Z25.11 | v92.81,40.69 v89.15,37.03 | v124.66,48.01 124.66,48.46 128.17,51.97 R13.1 | v152.86,77.42 152.4,77.42 150.88,75.89 145.24,75.89 142.34,73 137.92,73 137.77,73.15 137.16,73.15 136.25,72.24 v136.25,69.34
CNT6  (via drill 0.35)
  Top 0.152: Z22.1 123.29,43.28 123.29,45.11 125.42,47.24 125.42,53.65 125.88,54.1 126.49,54.1 128.17,55.78 R14.1 128.32,55.93 132.44,60.05 v133.04,60.05
  Bottom 0.152: v133.04,60.05 133.04,61.42 134.57,62.94 134.57,63.4 Z10.4
CNT7  (via drill 0.35)
  Top 0.152: v61.87,23.32 v61.87,21.18 | v72.24,40.84 72.24,41.15 78.33,47.24 86.11,47.24 90.22,51.36 90.22,52.88 89.92,53.19 89.92,53.8 90.22,54.1 92.66,54.1 95.56,51.21 101.35,51.21 103.17,53.03 108.81,53.03 111.1,50.75 112.93,50.75 114,49.68 114,49.07 114.45,48.62 117.81,48.62 122.83,53.65 124.21,53.65 128.17,57.61 128.17,59.59 R15.1 128.32,59.74 129.54,60.96 132.74,60.96 | 132.74,60.96 134.57,60.96 Z10.5 | v137.47,72.54 133.66,72.54 132.74,71.63 132.74,60.96
  Bottom 0.152: v61.87,21.18 61.87,17.37 63.4,15.85 63.4,15.24 Z25.12 | v61.87,23.32 61.87,30.48 v72.24,40.84 | Z21.10 153.77,77.57 153.77,76.5 151.03,73.76 143.56,73.76 142.34,72.54 v137.47,72.54
CNT8  (via drill 0.35)
  Top 0.152: v138.99,43.59 137.62,42.22 134.26,42.22 132.74,40.69 130.91,40.69 Z22.13 | v138.99,54.25 v138.99,52.58 | 142.19,68.58 142.19,67.97 139.9,65.68 v139.9,63.7 | 142.19,68.58 Z10.13 142.19,68.58 | v53.03,17.22 55.02,15.24 55.78,15.24 Z25.3 | v47.24,25.15 30.48,25.15 28.19,27.43 28.19,32.61 33.38,37.8 33.38,40.23 38.41,45.26 v38.41,49.07 | v96.32,95.86 97.99,97.54 136.7,97.54 141.28,92.96 155.3,92.96 156.51,94.18 156.51,94.34 157.12,94.94 157.89,94.94 158.5,94.34 158.5,84.89 156.21,82.6 Z21.11 | v140.66,70.1 142.19,68.58
  Bottom 0.152: v138.99,52.58 v138.99,43.59 | 134.72,58.52 v138.99,54.25 | 134.72,58.52 Z10.6 134.72,58.52 | 134.72,58.52 v139.9,63.7 | v53.03,17.22 53.03,19.36 v47.24,25.15 | v38.41,49.07 43.13,53.8 43.13,75.59 45.26,77.72 63.09,77.72 65.68,80.31 75.29,80.31 90.53,95.56 96.01,95.56 v96.32,95.86 | v140.66,70.1 140.66,71.48 141.43,72.24 146.76,72.24 147.98,73.46 151.18,73.46 154.53,76.81 154.53,77.72 155.91,79.1 157.28,79.1 157.89,79.7 157.89,80.77 156.21,82.45 Z21.11
CNT9
  Top 0.152: Z10.11 142.19,63.4 140.51,63.4 140.21,63.09 139.6,63.09 139.29,63.4 139.29,73.91 141.88,76.5 143.26,76.5 143.87,77.11 143.87,80.31 142.65,81.53 133.66,81.53 131.83,83.36 131.83,86.72 131.22,87.33 130.45,87.33 129.24,86.11 129.24,83.52 128.32,82.6 R21.1
CNT10  (via drill 0.35)
  Top 0.152: v137.77,74.37 136.25,75.89 134.26,75.89 133.04,77.11 133.04,77.88 131.22,79.7 129.84,79.7 127.25,82.3 127.25,82.91 128.17,83.82 128.17,86.26 R22.1 | v141.58,73.61 143.1,72.08 143.26,72.08 144.17,71.17 144.17,62.79 142.34,60.96 Z10.10
  Bottom 0.152: v137.77,74.37 140.82,74.37 v141.58,73.61
CNT11  (via drill 0.35)
  Top 0.152: R23.1 128.32,90.22 129.54,90.22 130.45,91.14 133.66,91.14 134.57,90.22 Z11.1 134.57,90.07 133.04,88.54 133.04,87.17 133.5,86.72 135.03,86.72 137.62,84.12 142.65,84.12 145.09,81.69 v145.09,61.27
  Bottom 0.152: v145.09,61.27 142.34,58.52 Z10.9
CNT12  (via drill 0.35)
  Top 0.152: v125.73,68.28 125.73,69.19 126.34,69.8 v126.34,77.27
  Bottom 0.152: v125.73,68.28 125.73,66.9 128.17,64.47 128.17,63.55 R16.1 | v126.34,77.27 126.34,78.18 129.69,81.53 131.06,81.53 133.35,83.82 133.35,84.12 134.26,85.04 134.57,85.04 Z11.3 134.72,85.19 138.07,88.54 142.65,88.54 144.17,90.07 148.59,90.07 Z21.1
CNT13
  Bottom 0.152: R17.1 128.32,67.36 128.32,69.8 129.84,71.32 129.84,76.5 133.04,79.7 133.04,80.92 134.57,82.45 Z11.4 134.72,82.6 138.53,86.41 142.95,86.41 144.17,87.63 Z21.2
CNT14  (via drill 0.35)
  Top 0.152: v130.76,73.61 128.32,71.17 R18.1
  Bottom 0.152: v130.76,73.61 132.13,74.98 132.13,77.57 134.57,80.01 Z11.5 134.72,80.01 140.82,86.11 149.05,86.11 150.57,87.63 Z21.13
CNT15  (via drill 0.35)
  Top 0.152: v132.13,79.7 132.44,79.7 134.57,77.57 Z11.6 | Z11.13 142.19,87.63 139.45,87.63 135.64,91.44 128.17,91.44 126.03,89.31 126.03,87.17 124.97,86.11 123.44,86.11 122.53,85.19 122.53,80.01 124.05,78.49 126.03,78.49 128.17,76.35 128.17,74.98 R19.1 | v132.74,45.87 134.11,47.24 143.87,47.24 | 143.87,47.24 147.68,47.24 148.59,48.16 Z19.2 | v140.51,54.25 140.51,50.6 141.88,49.23 143.26,49.23 143.87,48.62 143.87,47.24
  Bottom 0.152: v132.13,79.7 130.45,79.7 129.84,79.1 129.84,78.94 128.32,77.42 128.32,74.98 R19.1 | v132.74,45.87 131.37,44.5 130.15,44.5 123.75,38.1 123.29,38.1 Z22.3 | v140.51,54.25 140.51,64.01 140.06,64.47 134.26,64.47 132.74,65.99 132.74,74.98 134.57,76.81 134.57,77.42 Z11.6
CNT16  (via drill 0.35)
  Top 0.152: v133.96,83.82 140.97,83.82 142.19,82.6 Z11.11 142.34,82.45 144.47,80.31 v144.47,58.06 | v144.17,43.13 143.26,42.22 141.43,42.22 138.53,39.32 130,39.32 126.34,35.66 123.29,35.66 Z22.4 | v144.47,55.02 148.59,50.9 Z19.1
  Bottom 0.152: v133.96,83.82 128.93,78.79 128.32,78.79 R20.1 | v144.17,43.13 143.87,43.43 143.87,43.59 142.65,44.81 141.12,44.81 140.66,45.26 140.66,46.18 141.73,47.24 145.09,47.24 148.59,50.75 Z19.1 | v144.47,55.02 v144.47,58.06
CNT17  (via drill 0.35)
  Top 0.152: v58.98,14.63 55.93,17.68 Z25.2 | v71.02,5.79 74.98,5.79 75.29,6.1 79.4,6.1 v80.47,5.03 | v112.62,9.6 112.62,16.15 114.61,18.14 116.59,18.14 117.5,19.05 v117.5,19.96 | v131.52,41.91 v128.93,41.91 | v138.38,63.09 138.99,63.7 138.99,76.2 142.19,79.4 142.19,80.01 Z11.10
  Bottom 0.152: v58.98,14.63 58.98,14.17 59.28,13.87 59.28,10.52 61.87,7.92 61.87,7.32 62.79,6.4 70.41,6.4 v71.02,5.79 | v80.47,5.03 104.24,5.03 107.14,7.92 110.95,7.92 v112.62,9.6 | v117.5,19.96 118.26,19.96 119.94,21.64 121.92,21.64 122.53,22.25 122.53,26.21 121.31,27.43 121.31,35.66 122.83,37.19 124.21,37.19 v128.93,41.91 | v131.52,41.91 133.04,43.43 133.04,43.59 134.26,44.81 135.64,44.81 136.25,45.41 136.25,46.63 134.72,48.16 Z20.2 134.57,48.31 132.74,50.14 132.74,58.52 133.66,59.44 135.03,59.44 138.38,62.79 v138.38,63.09
DATA0  (via drill 0.35)
  Top 0.152: v80.62,29.87 RN1.1 | v138.38,28.04 138.53,27.89 142.95,27.89 144.17,26.67 146,26.67 Z27.2 | v133.35,28.04 132.89,28.04 129.84,24.99 124.51,24.99 123.6,24.08 v118.87,24.08 | v18.14,64.01 10.06,55.93 5.18,55.93 Z0.14 | Z3.14 73.61,71.17 72.69,72.08 59.89,72.08 55.78,67.97 v52.73,67.97 52.43,67.67 v32.31,67.67 | IC2.3 89.61,68.58 88.09,70.1 86.72,70.1 84.73,72.08 v84.73,74.22 | v76.66,39.32 78.79,39.32 79.1,39.01 84.28,39.01 85.5,40.23 86.72,40.23 87.94,41.45 87.94,43.89 90.53,46.48 v90.53,53.49
  Bottom 0.152: v80.62,29.87 81.38,29.87 84.58,26.67 96.77,26.67 98.45,28.35 98.45,28.8 98.75,29.11 100.28,29.11 RN2.1 100.43,29.11 103.17,26.36 103.17,19.36 106.98,15.54 108.97,15.54 109.58,16.15 109.58,17.53 116.13,24.08 v118.87,24.08 | v133.35,28.04 v138.38,28.04 | v18.14,64.01 18.14,63.7 19.96,61.87 24.38,61.87 25.3,60.96 Z1.9 25.45,60.96 26.52,60.96 32.31,66.75 v32.31,67.67 | v52.73,67.97 Z2.9 | v84.73,74.22 84.73,73.91 80.92,70.1 74.68,70.1 73.76,71.02 Z3.14 | RN1.1 76.2,38.86 v76.66,39.32 | v90.53,53.49 90.98,53.49 93.12,55.63 93.12,66.9 IC2.3
DATA1  (via drill 0.35)
  Top 0.152: v97.69,28.5 98.15,28.5 99.06,27.58 101.35,27.58 102.87,29.11 RN2.2 | v22.86,58.06 22.86,61.42 21.95,62.33 21.95,63.86 21.34,64.47 19.36,64.47 18.75,63.86 18.75,63.7 8.38,53.34 5.18,53.34 Z0.15 | v58.37,65.99 58.98,65.99 60.05,67.06 72.08,67.06 73.61,68.58 Z3.13 | v85.04,67.06 83.97,67.06 v83.06,66.14 | v31.7,58.52 34.14,60.96 v37.8,60.96 | v39.17,59.59 44.65,59.59 45.72,58.52 Z2.10 | v79.4,39.62 80.92,39.62 82.91,41.6 82.91,42.98 84.73,44.81 v85.34,44.81 | v94.79,55.47 94.79,58.83 94.94,58.98 94.94,60.66 v93.73,61.87 | v93.73,63.09 91.75,63.09 91.44,63.4 IC2.5
  Bottom 0.152: 78.79,34.29 78.79,33.53 79.7,32.61 79.7,32 84.73,26.98 96.16,26.98 v97.69,28.5 | 78.79,34.29 RN1.2 78.79,34.29 | v22.86,58.06 24.99,58.06 25.3,58.37 Z1.10 25.45,58.52 v31.7,58.52 | v58.37,65.99 52.12,59.74 48.62,59.74 47.4,58.52 45.72,58.52 Z2.10 | v85.04,67.06 88.54,67.06 89.31,66.29 89.31,66.14 91.44,64.01 91.44,63.55 IC2.5 | v83.06,66.14 83.06,66.75 82.14,67.67 74.68,67.67 73.76,68.58 Z3.13 | v39.17,59.59 v37.8,60.96 | 78.79,34.29 78.79,35.81 79.4,36.42 v79.4,39.62 | v85.34,44.81 85.34,46.02 v94.79,55.47 | v93.73,63.09 v93.73,61.87
DATA2  (via drill 0.35)
  Top 0.152: v82.91,35.81 81.38,34.29 RN1.3 | v99.67,30.94 103.17,30.94 104.85,29.26 105.31,29.26 RN2.3 | v13.72,60.96 5.18,60.96 Z0.12 | v55.93,65.38 59.59,65.38 59.89,65.08 72.69,65.08 73.61,65.99 Z3.12 | v37.64,53.8 v33.53,53.8 | v39.93,54.56 44.5,54.56 45.72,55.78 Z2.11 | v74.68,56.39 69.65,56.39 68.89,57.15 v57.45,57.15
  Bottom 0.152: v82.91,35.81 82.91,36.73 82.75,36.88 82.75,49.68 91.44,58.37 IC2.7 | v99.67,30.94 97.99,30.94 95.4,28.35 93.57,28.35 90.22,31.7 80.92,31.7 80.62,32 80.62,33.68 81.23,34.29 | 81.23,34.29 RN1.3 81.23,34.29 | 26.98,53.8 25.45,55.32 25.45,55.78 Z1.11 | 26.98,53.8 26.98,52.88 26.52,52.43 23.16,52.43 20.73,54.86 19.36,54.86 13.72,60.5 v13.72,60.96 | 45.72,56.39 45.72,55.93 Z2.11 45.72,56.39 | 45.72,56.39 44.04,58.06 44.04,58.67 45.41,60.05 50.6,60.05 v55.93,65.38 | v33.53,53.8 26.98,53.8 | v37.64,53.8 39.17,53.8 v39.93,54.56 | 81.23,34.29 81.23,39.93 80.01,41.15 80.01,52.12 76.2,55.93 75.13,55.93 v74.68,56.39 | v57.45,57.15 57,56.69 56.24,56.69 55.17,57.76 55.17,58.67 54.86,58.98 48.31,58.98 45.72,56.39
DATA3  (via drill 0.35)
  Top 0.152: 97.99,39.32 89.31,39.32 88.24,38.25 85.65,38.25 84.73,37.34 | 97.99,39.32 v100.43,39.32 | 84.73,37.34 84.73,35.2 RN1.4 | v97.99,52.43 99.06,53.49 99.06,55.78 IC2.9 | 97.99,39.32 v97.99,41.91 | v48.62,54.25 44.65,54.25 43.74,53.34 40.69,53.34 Z1.13 | v68.58,56.54 64.16,56.54 Z2.13 | v37.8,51.51 v36.12,49.84 | 84.73,37.34 83.97,38.1 74.07,38.1 v73.76,37.8 | v70.71,43.28 70.71,43.89 70.1,44.5 68.12,44.5 v67.97,44.35
  Bottom 0.152: v100.43,39.32 100.89,39.78 101.8,39.78 101.96,39.62 102.11,39.62 103.78,37.95 103.78,36.42 107.9,32.31 107.9,29.26 RN2.4 | v97.99,41.91 v97.99,52.43 | v48.62,54.25 60.05,54.25 Z2.13 | Z3.11 73.61,63.4 73.61,62.94 72.08,61.42 72.08,60.05 v68.58,56.54 68.28,56.24 68.28,48.01 67.97,47.7 v67.97,44.35 | v36.12,49.84 19.36,49.84 7.32,61.87 4.72,61.87 3.5,63.09 3.5,69.04 5.03,70.56 5.03,71.02 Z0.8 | v37.8,51.51 38.71,51.51 40.54,53.34 Z1.13 | v73.76,37.8 73.76,40.23 v70.71,43.28
DATA4  (via drill 0.35)
  Top 0.152: v95.71,57.61 v95.71,55.47 | v110.95,34.9 110.95,32.46 110.49,32 110.49,29.26 RN2.5 | v102.26,42.37 103.17,43.28 103.17,45.57 100.74,48.01 v100.74,49.53 | v51.05,56.84 44.65,56.84 43.74,55.93 40.69,55.93 Z1.14 | v19.66,69.8 15.85,73.61 5.18,73.61 Z0.7 | v33.53,59.44 37.03,59.44 v37.64,58.83 | 93.12,65.84 93.12,65.68 92.2,64.77 90.22,64.77 89.31,63.86 89.31,63.25 87.94,61.87 86.56,61.87 85.19,60.5 85.19,57.3 81.53,53.65 75.59,53.65 73,51.05 63.4,51.05 62.48,50.14 61.87,50.14 59.28,52.73 59.28,54.1 60.96,55.78 Z2.14 | 93.12,65.84 93.12,68.89 92.51,69.49 90.68,69.49 89.15,71.02 87.63,71.02 Z4.14 | IC2.11 97.69,60.96 95.25,63.4 v95.25,63.7 | 93.12,65.84 v93.73,65.23
  Bottom 0.152: IC2.11 v95.71,57.61 | RN1.5 86.41,34.29 86.41,36.73 87.63,37.95 87.63,44.96 87.48,45.11 87.48,47.24 v95.71,55.47 96.32,55.47 98.91,52.88 98.91,51.82 100.74,49.99 v100.74,49.53 | v110.95,34.9 110.49,34.9 109.58,35.81 109.58,37.64 104.85,42.37 v102.26,42.37 | v51.05,56.84 55.17,56.84 56.08,55.93 60.96,55.93 Z2.14 | v19.66,69.8 31.09,69.8 33.53,67.36 v33.53,59.44 | v37.64,58.83 40.54,55.93 Z1.14 | v93.73,65.23 v95.25,63.7
DATA5  (via drill 0.35)
  Top 0.152: v96.62,66.14 99.06,66.14 IC2.13 | v51.82,57.45 44.65,57.45 43.74,58.37 40.69,58.37 Z1.15 | v22.55,63.86 22.55,65.84 21.34,67.06 19.81,67.06 18.29,68.58 5.18,68.58 Z0.9 | v28.5,63.86 33.98,63.86 v36.12,61.72 | v75.59,56.54 73.76,58.37 60.96,58.37 Z2.15 | v108.97,31.09 103.48,31.09 v102.11,32.46 | Z4.13 84.12,68.58 82.3,66.75 v81.69,66.75
  Bottom 0.152: v96.62,66.14 95.86,66.14 92.51,69.49 88.54,69.49 Z4.13 | v51.82,57.45 55.02,57.45 56.08,56.39 58.98,56.39 60.96,58.37 Z2.15 60.96,58.52 62.64,60.2 62.64,62.03 65.08,64.47 66.9,64.47 69.49,67.06 80.92,67.06 81.23,66.75 v81.69,66.75 | v22.55,63.86 23.01,63.86 24.38,62.48 27.13,62.48 v28.5,63.86 | v36.12,61.72 39.32,58.52 40.54,58.52 Z1.15 | 88.7,34.29 88.39,34.29 86.72,32.61 83.52,32.61 82.3,33.83 82.3,49.53 80.31,51.51 80.31,52.27 76.05,56.54 v75.59,56.54 | 88.7,34.29 88.85,34.29 RN1.6 88.7,34.29 | v108.97,31.09 110.64,31.09 112.47,29.26 112.93,29.26 RN2.6 | v102.11,32.46 96.77,32.46 94.34,30.02 92.96,30.02 88.7,34.29
DATA6  (via drill 0.35)
  Top 0.152: v109.88,23.16 106.98,23.16 v103.78,26.36 | v97.08,31.85 93.88,31.85 RN1.7 | Z1.16 40.69,60.96 43.74,60.96 45.26,62.48 62.18,62.48 v62.94,63.25 62.94,63.55 61.72,64.77 39.93,64.77 38.41,66.29 v30.79,66.29 | v18.44,66.14 5.18,66.14 Z0.10 | v75.44,60.35 74.98,60.35 74.68,60.05 61.87,60.05 Z2.16 | v81.23,32.31 79.7,33.83 79.7,35.36 78.18,36.88 v78.03,36.88
  Bottom 0.152: v109.88,23.16 115.52,28.8 115.52,29.11 RN2.7 | v103.78,26.36 101.35,28.8 101.35,30.18 99.67,31.85 v97.08,31.85 96.62,31.85 94.49,29.72 92.66,29.72 90.07,32.31 v81.23,32.31 | v62.94,63.25 62.94,62.94 Z2.16 | v18.44,66.14 19.36,67.06 30.02,67.06 v30.79,66.29 | 75.59,58.83 75.44,58.98 v75.44,60.35 | 75.59,58.83 79.1,55.32 87.17,55.32 89.61,57.76 89.61,63.55 87.63,65.53 87.63,65.99 Z4.12 | v78.03,36.88 78.03,40.69 77.72,41 77.72,50.44 74.83,53.34 74.83,54.41 74.37,54.86 73.91,54.86 73.61,55.17 73.61,56.69 75.59,58.67 75.59,58.83
DATA7  (via drill 0.35)
  Top 0.152: v94.03,30.63 94.34,30.63 95.71,29.26 95.71,29.11 98.15,26.67 102.56,26.67 106.68,22.55 109.58,22.55 v109.88,22.25 | v18.14,64.92 17.53,64.31 17.53,63.86 12.19,58.52 5.18,58.52 Z0.13 | v29.57,64.92 39.17,64.92 40.54,63.55 Z1.17 40.69,63.55 41.6,64.47 46.79,64.47 47.7,63.55 60.96,63.55 Z2.17 | v82.91,63.86 83.21,63.55 87.63,63.55 Z4.11 | v86.11,37.34 86.41,37.64 90.07,37.64 93.42,34.29 93.88,34.29 RN1.8 | v81.23,51.51 v84.89,47.85 | v83.82,56.84 v81.23,54.25
  Bottom 0.152: v94.03,30.63 94.03,34.29 RN1.8 | v109.88,22.25 110.34,22.25 115.67,27.58 116.59,27.58 118.11,29.11 RN2.8 | v29.57,64.92 v18.14,64.92 | v82.91,63.86 82.91,65.38 82.3,65.99 82.3,67.06 81.99,67.36 69.34,67.36 66.75,64.77 62.18,64.77 60.96,63.55 Z2.17 | v86.11,37.34 86.11,37.64 87.33,38.86 87.33,39.47 86.56,40.23 86.11,40.23 84.73,41.6 84.73,47.7 v84.89,47.85 | v81.23,54.25 v81.23,51.51 | v83.82,56.84 83.82,57.76 84.58,58.52 87.17,58.52 89.31,60.66 89.31,61.72 87.63,63.4 Z4.11
EAR
  Top 0.152: IC2.14 99.67,67.97 103.33,67.97 107.9,63.4 107.9,57.61 108.66,56.84 109.27,56.84 109.58,57.15 111.71,57.15 Z17.13
GND  (via drill 0.35)  (1 unrouted)
  Top 0.152: v28.35,80.92 31.09,80.92 39.01,88.85 44.35,88.85 C1.1 | 41.91,2.59 31.7,2.59 Z29.8 25.45,3.81 24.54,2.9 22.55,2.9 21.64,3.81 | 41.91,2.59 Z26.7 41.91,2.59 | 21.64,7.62 21.64,3.81 | 21.64,3.81 C18.1 21.64,3.81 | 21.64,7.62 C19.1 21.64,7.62 | 21.64,15.24 21.64,11.43 | 21.64,11.43 C20.1 21.64,11.43 | 21.64,15.24 C21.1 | 21.64,15.24 22.86,16.46 22.86,20.27 C12.- | 21.64,15.24 C21.1 | 21.64,11.43 21.64,7.62 | C10.1 15.24,34.29 14.02,35.51 C9.- 13.87,35.51 12.65,35.51 10.21,33.07 7.62,33.07 C7.- 7.62,32.92 5.33,30.63 3.81,30.63 POWER-IN.2 | C17.1 12.8,2.59 12.8,6.25 C16.1 12.8,6.4 12.8,10.06 C15.1 12.8,10.21 12.8,11.43 | 12.8,11.43 12.8,13.87 C14.1 12.8,14.02 12.8,15.24 | 12.8,15.24 12.8,17.68 C13.1 12.65,17.83 11.43,19.05 C11.- | 12.8,11.43 5.18,11.43 IC1.2 | 12.8,15.24 21.49,15.24 C21.1 | v14.63,38.41 14.63,55.78 19.81,60.96 20.27,60.96 Z0.29 | Z9.2 146.91,70.26 146.91,71.48 148.59,73.15 148.59,74.83 Z21.7 | v152.71,76.35 155.14,73.91 157.12,73.91 158.8,75.59 158.8,96.32 156.67,98.45 155.6,98.45 153.77,96.62 COMPOSITE-OUT.2 | Z20.7 134.72,35.51 134.72,31.55 137.47,28.8 137.47,16.76 134.72,14.02 Z23.7 | Z19.7 148.59,35.51 149.35,35.51 157.43,27.43 157.43,26.67 AUDIO-IN.2 157.43,26.52 157.43,26.21 155.6,24.38 155.6,16.46 154.08,14.94 152.71,14.94 148.28,10.52 | 148.28,10.52 149.81,8.99 R6.1 | 148.28,10.52 146.15,12.65 146.15,13.87 Z27.7 146,14.02 144.47,15.54 144.47,16.31 142.34,18.44 142.34,19.05 Z23.10 | Z17.8 104.24,47.09 105,47.09 106.83,48.92 108.36,48.92 v109.27,48.01 110.19,47.09 110.19,46.63 111.25,45.57 120.24,45.57 120.55,45.87 120.55,46.48 120.09,46.94 115.67,46.94 Z16.8
  Top 0.152: v99.82,51.82 99.52,51.51 95.71,51.51 91.44,55.78 IC2.8 91.44,55.93 v86.87,55.93 | 113.39,68.28 115.21,68.28 116.74,69.8 Z6.9 | 113.39,68.28 107.29,68.28 105.77,69.8 104.24,69.8 Z5.9 104.09,69.95 103.48,69.95 101.35,72.08 96.93,72.08 94.34,74.68 93.73,74.68 91.44,76.96 91.44,78.64 Z15.8 | 113.39,68.28 113.39,64.47 111.86,62.94 111.86,62.33 Z17.15 | v54.56,58.37 58.06,61.87 65.08,61.87 65.99,60.96 Z3.9 66.14,60.96 67.06,61.87 74.68,61.87 75.59,60.96 77.72,60.96 | 77.72,60.96 Z4.9 | v105.77,13.26 105.77,13.72 106.98,14.94 108.36,14.94 109.58,16.15 109.58,19.36 108.05,20.88 108.05,21.49 Z28.1 | Z7.9 82.6,3.81 88.24,3.81 89.15,2.9 92.96,2.9 93.88,3.81 Z8.9 94.03,3.81 94.94,2.9 102.72,2.9 103.63,3.81 107.9,3.81 Z28.8 | 77.72,60.96 v77.72,60.35 | 41.91,2.59 47.55,2.59 49.07,4.12 51.51,4.12 53.34,5.94 55.02,5.94 55.78,5.18 Z25.7
  Bottom 0.152: 54.56,89 53.65,89.92 46.63,89.92 45.72,89 44.5,89 C1.1 | Z1.12 25.3,53.34 25.3,53.95 21.95,57.3 21.95,59.44 20.42,60.96 Z0.29 20.27,60.96 17.53,63.7 17.53,72.85 19.36,74.68 20.73,74.68 23.16,77.11 25.91,77.11 28.35,79.55 v28.35,80.92 | C11.- 3.81,22.86 3.81,30.48 POWER-IN.2 | v14.63,38.41 14.63,36.27 14.02,35.66 C9.- | Q1.3 132.13,92.81 132.89,92.81 137.01,96.93 137.01,97.84 137.92,98.75 151.49,98.75 153.62,96.62 COMPOSITE-OUT.2 | Z11.7 134.72,74.98 140.36,74.98 141.88,76.5 151.03,76.5 152.55,78.03 153.16,78.03 153.47,77.72 153.47,77.11 v152.71,76.35 151.33,74.98 148.59,74.98 Z21.7 | Z10.12 142.34,66.14 146.15,66.14 Z9.2 151.03,66.14 156.21,66.14 Z9.12 156.21,65.99 157.89,64.31 157.89,63.25 157.12,62.48 155.75,62.48 149.2,55.93 148.59,55.93 Z9.7 148.59,55.78 146.46,53.65 138.68,53.65 136.55,55.78 134.72,55.78 Z10.7 134.57,55.78 134.57,52.73 133.04,51.21 133.04,50.44 134.26,49.23 135.64,49.23 136.55,48.31 136.55,37.49 134.72,35.66 Z20.7 | 142.19,19.05 137.16,14.02 134.72,14.02 Z23.7 134.57,13.87 126.95,13.87 120.7,7.62 Z24.7 120.55,7.62 119.18,7.62 116.59,10.21 | 142.19,19.05 Z23.10 142.19,19.05 | 142.19,19.05 140.66,20.57 140.66,22.25 137.47,25.45 131.37,25.45 128.93,27.89 123.29,27.89 Z22.7 | 151.03,7.77 151.03,5.18 R5.1 | 151.03,7.77 149.96,8.84 R6.1 | 151.03,7.77 152.55,7.77 156.06,11.28 157.43,11.28 AUDIO-OUT.2 | v99.82,51.82 99.82,51.36 104.09,47.09 Z17.8 | v109.27,48.01 108.66,47.4 108.05,47.4 107.75,47.7 107.75,61.57 109.88,63.7 110.49,63.7 111.86,62.33 Z17.15 | Z2.12 46.63,53.34 51.66,58.37 v54.56,58.37 | 116.59,10.21 113.23,10.21
  Bottom 0.152: 113.23,10.21 112.32,10.21 111.1,8.99 108.05,8.99 Z28.6 | v105.77,13.26 106.22,13.26 107.14,12.34 116.59,12.34 117.2,11.73 117.2,10.82 116.59,10.21 | 61.27,35.51 62.18,35.51 Q3.1 | 61.27,35.51 59.74,35.51 54.71,30.48 54.71,22.86 C8.2 54.56,22.86 54.56,21.95 53.95,21.34 53.95,12.65 55.47,11.12 56.84,11.12 57.45,10.52 57.45,6.71 55.93,5.18 Z25.7 55.93,5.03 58.37,2.59 68.58,2.59 | 68.58,2.59 Z18.8 68.58,2.59 | 68.58,2.59 68.89,2.59 70.1,3.81 82.45,3.81 Z7.9 | 113.23,10.21 113.23,9.3 111.25,7.32 106.98,7.32 106.38,6.71 106.38,5.33 107.9,3.81 Z28.8 | 61.27,35.51 61.27,44.96 65.99,49.68 65.99,60.96 Z3.9 | v86.87,55.93 86.56,55.93 86.26,55.63 79.25,55.63 77.72,57.15 v77.72,60.35
N$1  (via drill 0.35)
  Top 0.152: 36.42,19.05 32.46,19.05 31.24,20.27 29.41,20.27 27.28,22.4 27.28,40.39 30.18,43.28 30.18,58.22 25.91,62.48 24.38,62.48 23.47,63.4 23.47,68.58 24.99,70.1 39.62,70.1 40.54,71.02 Z1.20 | 36.42,19.05 Z29.15 | v139.75,17.53 139.75,15.24 v126.49,1.98 | v40.08,6.1 40.08,11.43 38.56,12.95 37.19,12.95 36.42,13.72 36.42,19.05
  Bottom 0.152: v139.75,17.53 139.75,22.71 137.31,25.15 124.05,25.15 121.61,27.58 121.61,33.38 122.22,33.98 124.21,33.98 127.71,30.48 130.76,30.48 Z22.9 | v126.49,1.98 83.97,1.98 83.21,1.22 55.32,1.22 50.44,6.1 v40.08,6.1 | Z1.18 40.54,66.14 40.54,66.75 39.01,68.28 39.01,69.49 40.54,71.02 Z1.20
N$2
  Top 0.152: Z29.13 38.1,14.02 40.69,14.02 Z26.2 40.23,16.92 40.23,18.14 40.54,18.44 40.54,22.86 R26.1
N$3  (via drill 0.35)
  Top 0.152: v44.35,23.77 40.23,23.77 39.62,23.16 39.62,22.55 39.78,22.4 39.78,18.75 38.1,17.07 38.1,16.61 Z29.14 | v50.75,41.3 50.75,51.51 v56.54,57.3 | v126.95,32.92 125.12,32.92 123.6,31.39 v115.82,31.39 | v105.46,22.25 101.35,26.36 94.18,26.36 92.35,24.54 92.35,23.77 93.57,22.55 94.94,22.55 95.56,21.95 95.56,21.18 94.64,20.27 80.62,20.27 76.5,16.15 66.45,16.15 64.31,14.02 61.27,14.02 58.06,10.82 57.45,10.82 57.15,11.12 57.15,12.04 57.45,12.34 57.45,13.11 56.54,14.02 47.24,14.02 v44.96,11.73
  Bottom 0.152: v44.35,23.77 48.92,28.35 48.92,37.49 51.36,39.93 51.36,40.69 v50.75,41.3 | v56.54,57.3 56.54,58.52 58.98,60.96 58.98,64.01 60.96,65.99 Z2.18 60.96,66.14 59.28,67.82 59.28,68.89 60.96,70.56 60.96,71.02 Z2.20 | v126.95,32.92 130.76,32.92 Z22.10 | v115.82,31.39 114,29.57 114,28.19 108.36,22.55 105.77,22.55 v105.46,22.25 | v44.96,11.73 40.84,11.73 39.78,12.8 39.78,14.78 38.1,16.46 Z29.14
N$4  (via drill 0.35)
  Top 0.152: R5.2 153.62,5.18 152.71,6.1 150.88,6.1 149.96,5.18 146.15,5.18 C3.2 146,5.03 145.09,4.12 143.1,4.12 v137.31,9.91 | v117.5,60.66 114.61,60.66 113.69,59.74 111.86,59.74 Z17.14 | v119.48,54.1 119.48,53.8 v118.72,53.03 | v118.72,40.69 119.48,40.69 121.16,39.01 124.21,39.01 v125.58,37.64 | v127.25,33.83 127.25,33.53 127.56,33.22 127.56,31.24 v126.49,30.18 | v123.14,24.99 v126.64,28.5 | v123.14,19.96 123.14,14.94 v126.8,11.28
  Bottom 0.152: v117.5,60.66 117.5,56.08 v119.48,54.1 | v118.72,40.69 v118.72,53.03 | v125.58,37.64 125.58,35.51 v127.25,33.83 | v126.49,30.18 126.49,28.65 v126.64,28.5 | v123.14,19.96 v123.14,24.99 | v126.8,11.28 135.94,11.28 v137.31,9.91
N$5
  Top 0.152: Z5.5 104.24,80.01 109.73,80.01 110.64,80.92 115.82,80.92 116.74,80.01 Z6.5
  Bottom 0.152: Z15.3 92.05,91.44 98.75,84.73 100.13,84.73 102.56,82.3 102.56,81.53 104.09,80.01 Z5.5 | R11.2 130.76,45.72 130.76,46.94 129.24,48.46 129.24,52.43 127.41,54.25 126.03,54.25 124.05,56.24 122.07,56.24 118.42,59.89 118.42,66.29 113.84,70.87 113.84,77.42 116.43,80.01 116.74,80.01 Z6.5
N$6
  Top 0.152: Z24.3 120.7,17.68 120.7,15.24 Z24.4 120.55,15.24 120.55,14.63 118.57,12.65 118.57,8.08 117.81,7.32 94.94,7.32 94.03,6.4 Z8.8 93.88,6.4 92.96,7.32 89.15,7.32 88.24,6.4 82.6,6.4 Z7.8
N$7  (via drill 0.35)
  Top 0.152: Z5.8 104.24,72.39 109.12,72.39 110.03,73.3 115.82,73.3 116.74,72.39 Z6.8 | Z24.1 120.7,22.86 125.88,22.86 127.71,24.69 133.2,24.69 133.66,25.15 135.64,25.15 136.25,24.54 136.25,23.16 134.72,21.64 Z23.4 | v126.34,54.86 125.88,54.41 125.73,54.41 124.82,53.49 124.82,51.66 123.6,50.44 122.07,50.44 v120.24,48.62
  Bottom 0.152: v126.34,54.86 126.34,55.93 124.21,58.06 122.83,58.06 119.18,61.72 119.18,69.49 116.89,71.78 116.89,72.39 Z6.8 | v120.24,48.62 120.24,47.4 119.33,46.48 119.33,26.67 120.7,25.3 120.7,22.86 Z24.1
N$8  (via drill 0.35)
  Top 0.152: v114.61,72.69 111.86,69.95 Z5.10 | v52.73,6.86 49.53,10.06 Z26.11 | v53.65,5.33 54.86,4.12 65.23,4.12 67.51,6.4 80.01,6.4 81.69,4.72 89.15,4.72 90.07,3.81 Z7.10 90.22,3.81 91.14,4.72 95.1,4.72 96.01,3.81 101.5,3.81 Z8.10 | v114.45,76.81 113.08,76.81 112.78,76.5 99.36,76.5 93.42,82.45 93.42,89.31 92.2,90.53 70.87,90.53 67.67,93.73 55.63,93.73 49.84,87.94 46.63,87.94 45.41,89.15 45.41,89.31 44.81,89.92 39.62,89.92 32,82.3 13.87,82.3 v12.5,80.92 | v5.79,72.39 4.42,72.39 1.52,69.49 1.52,40.84 v6.1,36.27
  Bottom 0.152: 114.61,76.81 114.61,77.72 115.67,78.79 117.96,78.79 122.83,73.91 122.83,71.48 124.36,69.95 Z6.10 | 114.61,76.81 v114.61,72.69 | 52.73,6.4 52.73,6.25 v53.65,5.33 | 52.73,6.4 v52.73,6.86 | v114.45,76.81 114.61,76.81 | v12.5,80.92 12.5,79.1 v5.79,72.39 | v6.1,36.27 6.1,29.41 22.4,13.11 25.6,13.11 28.19,10.52 39.17,10.52 41.15,8.53 46.18,8.53 48.31,6.4 52.73,6.4
N$10
  Top 0.152: Z19.3 147.07,44.2 138.68,44.2 137.77,43.28 134.72,43.28 Z20.4
N$11
  Top 0.152: Z25.1 55.93,20.42 58.06,20.42 64.31,26.67 78.33,26.67 85.04,33.38 85.04,37.19 85.8,37.95 99.06,37.95 99.82,38.71 101.04,38.71 101.19,38.56 102.11,38.56 102.41,38.86 112.32,38.86 115.21,41.76 127.71,41.76 129.84,39.62 133.66,39.62 134.57,40.54 Z20.5
N$12
  Top 0.152: C3.1 143.56,5.18 144.78,5.18 147.52,7.92 151.49,7.92 152.4,8.84 R6.2 152.4,8.99 157.43,14.02 157.43,24.08 AUDIO-IN.1
N$13
  Top 0.152: Z5.6 104.24,77.57 109.88,77.57 110.8,78.49 115.82,78.49 116.74,77.57 Z6.6
  Bottom 0.152: R12.2 130.76,48.31 130.76,50.75 129.54,51.97 129.54,53.34 124.82,58.06 124.82,66.6 118.72,72.69 118.72,73 117.81,73.91 115.82,73.91 115.21,74.52 115.21,75.89 116.74,77.42 Z6.6 | Z15.5 91.44,86.26 92.05,86.26 98.6,79.7 101.96,79.7 104.09,77.57 Z5.6
N$14
  Bottom 0.152: Z20.11 142.34,43.13 142.34,42.52 146.91,37.95 146.91,30.94 153.62,24.23 Z27.12
N$15
  Top 0.152: Z20.8 142.34,35.51 142.34,34.9 152.09,25.15 152.09,23.16 153.62,21.64 Z27.11
N$16  (via drill 0.35)
  Top 0.152: v86.56,54.71 v89.61,51.66 | v74.22,55.47 66.9,55.47 v62.18,50.75 | v49.53,31.39 47.09,28.96 44.04,28.96 42.98,27.89 42.98,27.58 42.22,26.82 36.42,26.82 35.36,27.89 35.36,28.35 34.75,28.96 30.18,28.96 29.26,28.04 X8.1